# EAGLE schematic NS_ARM_Control_07_15_2017 (EAGLE 6.6.0)
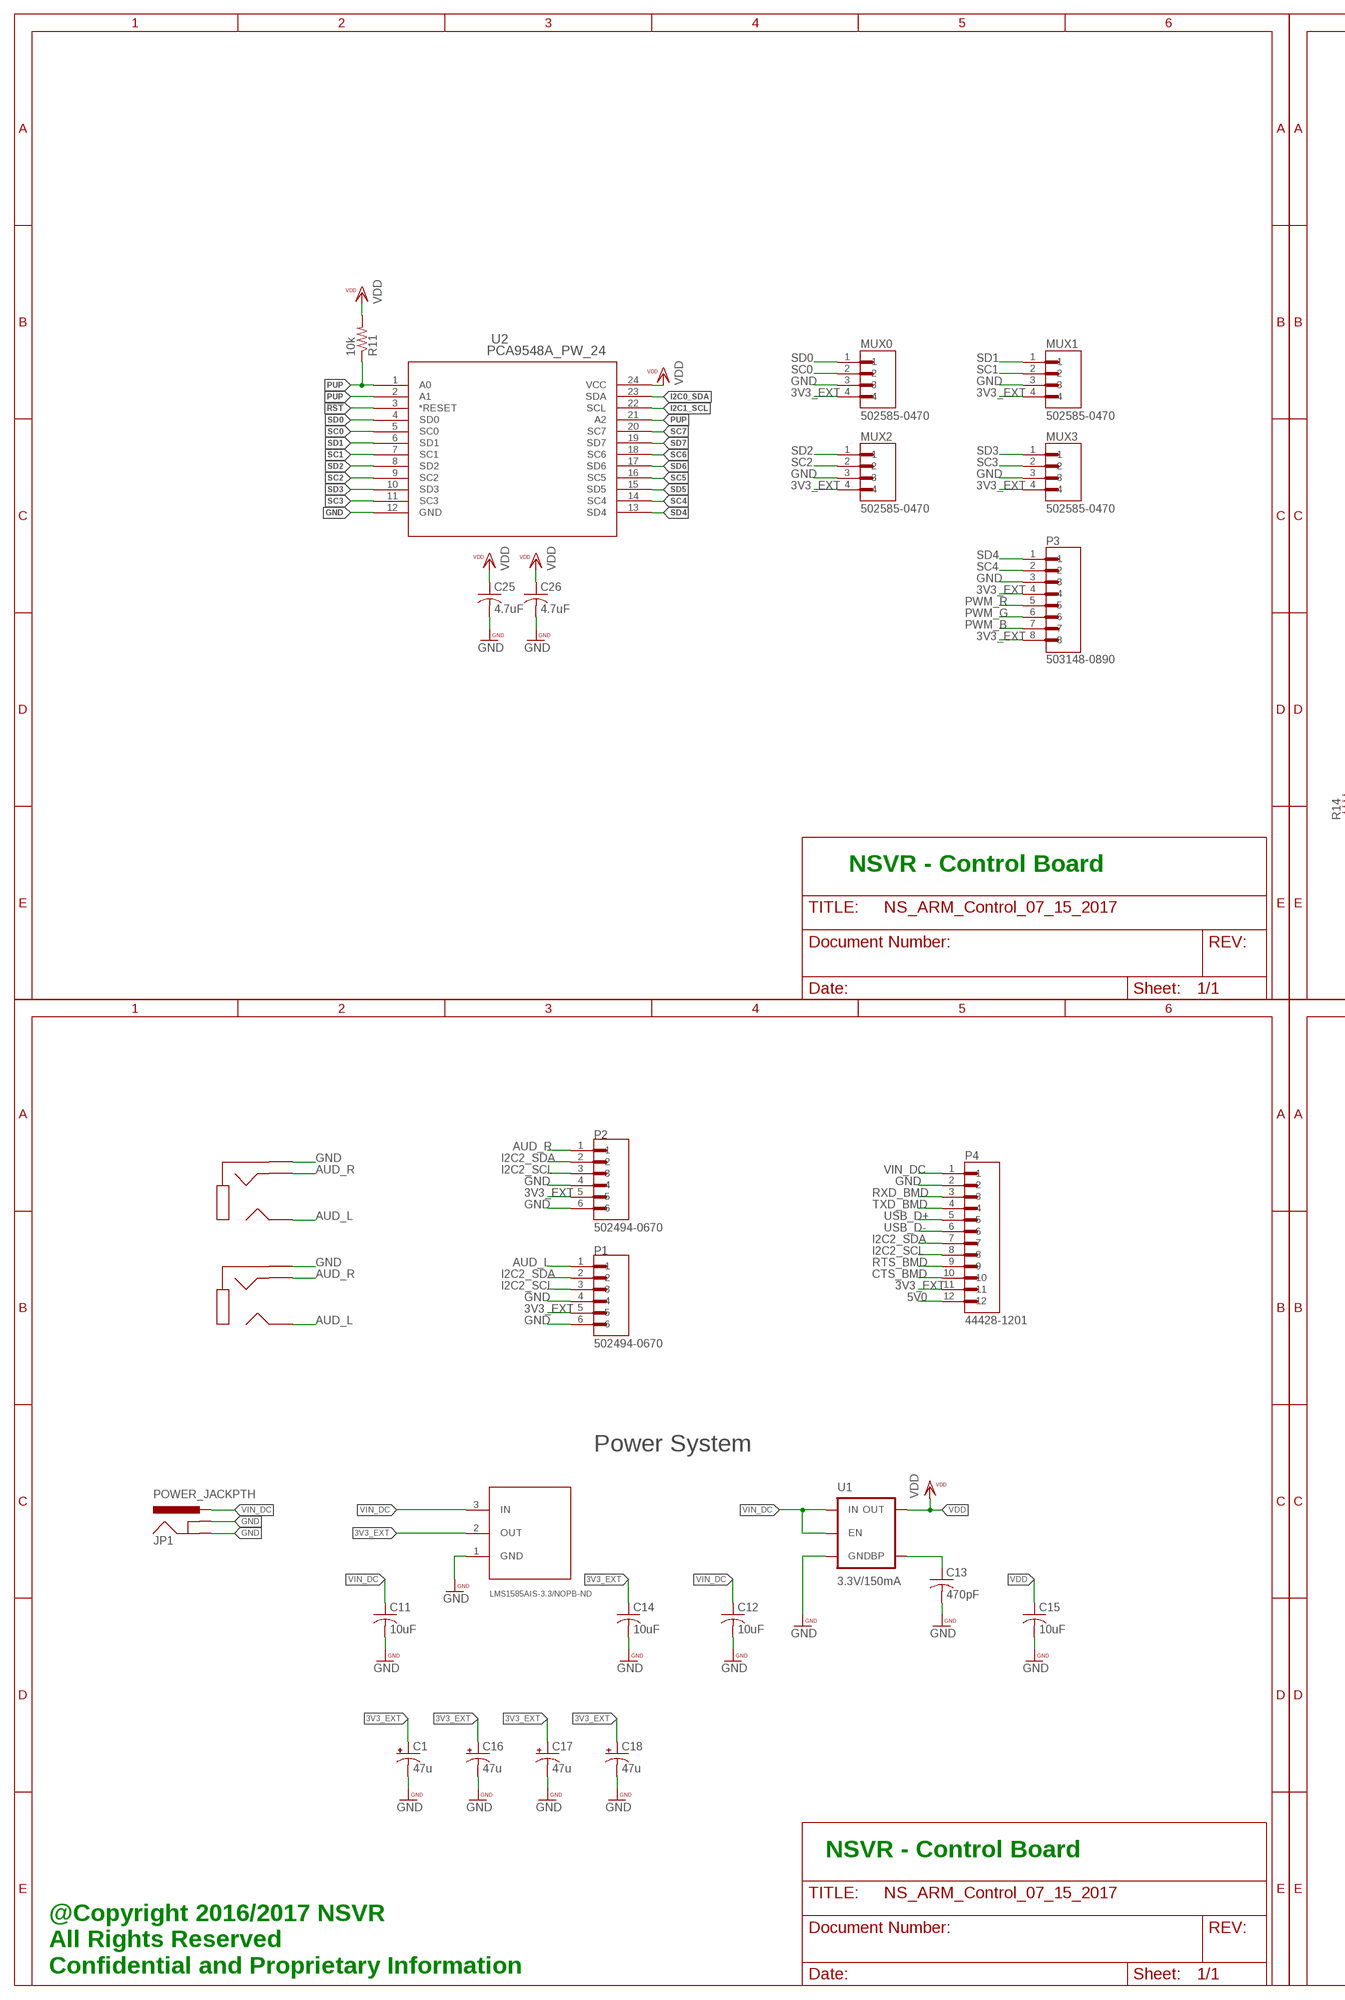
[diagram p0: schematic, sheet 1, part 1 of 2]
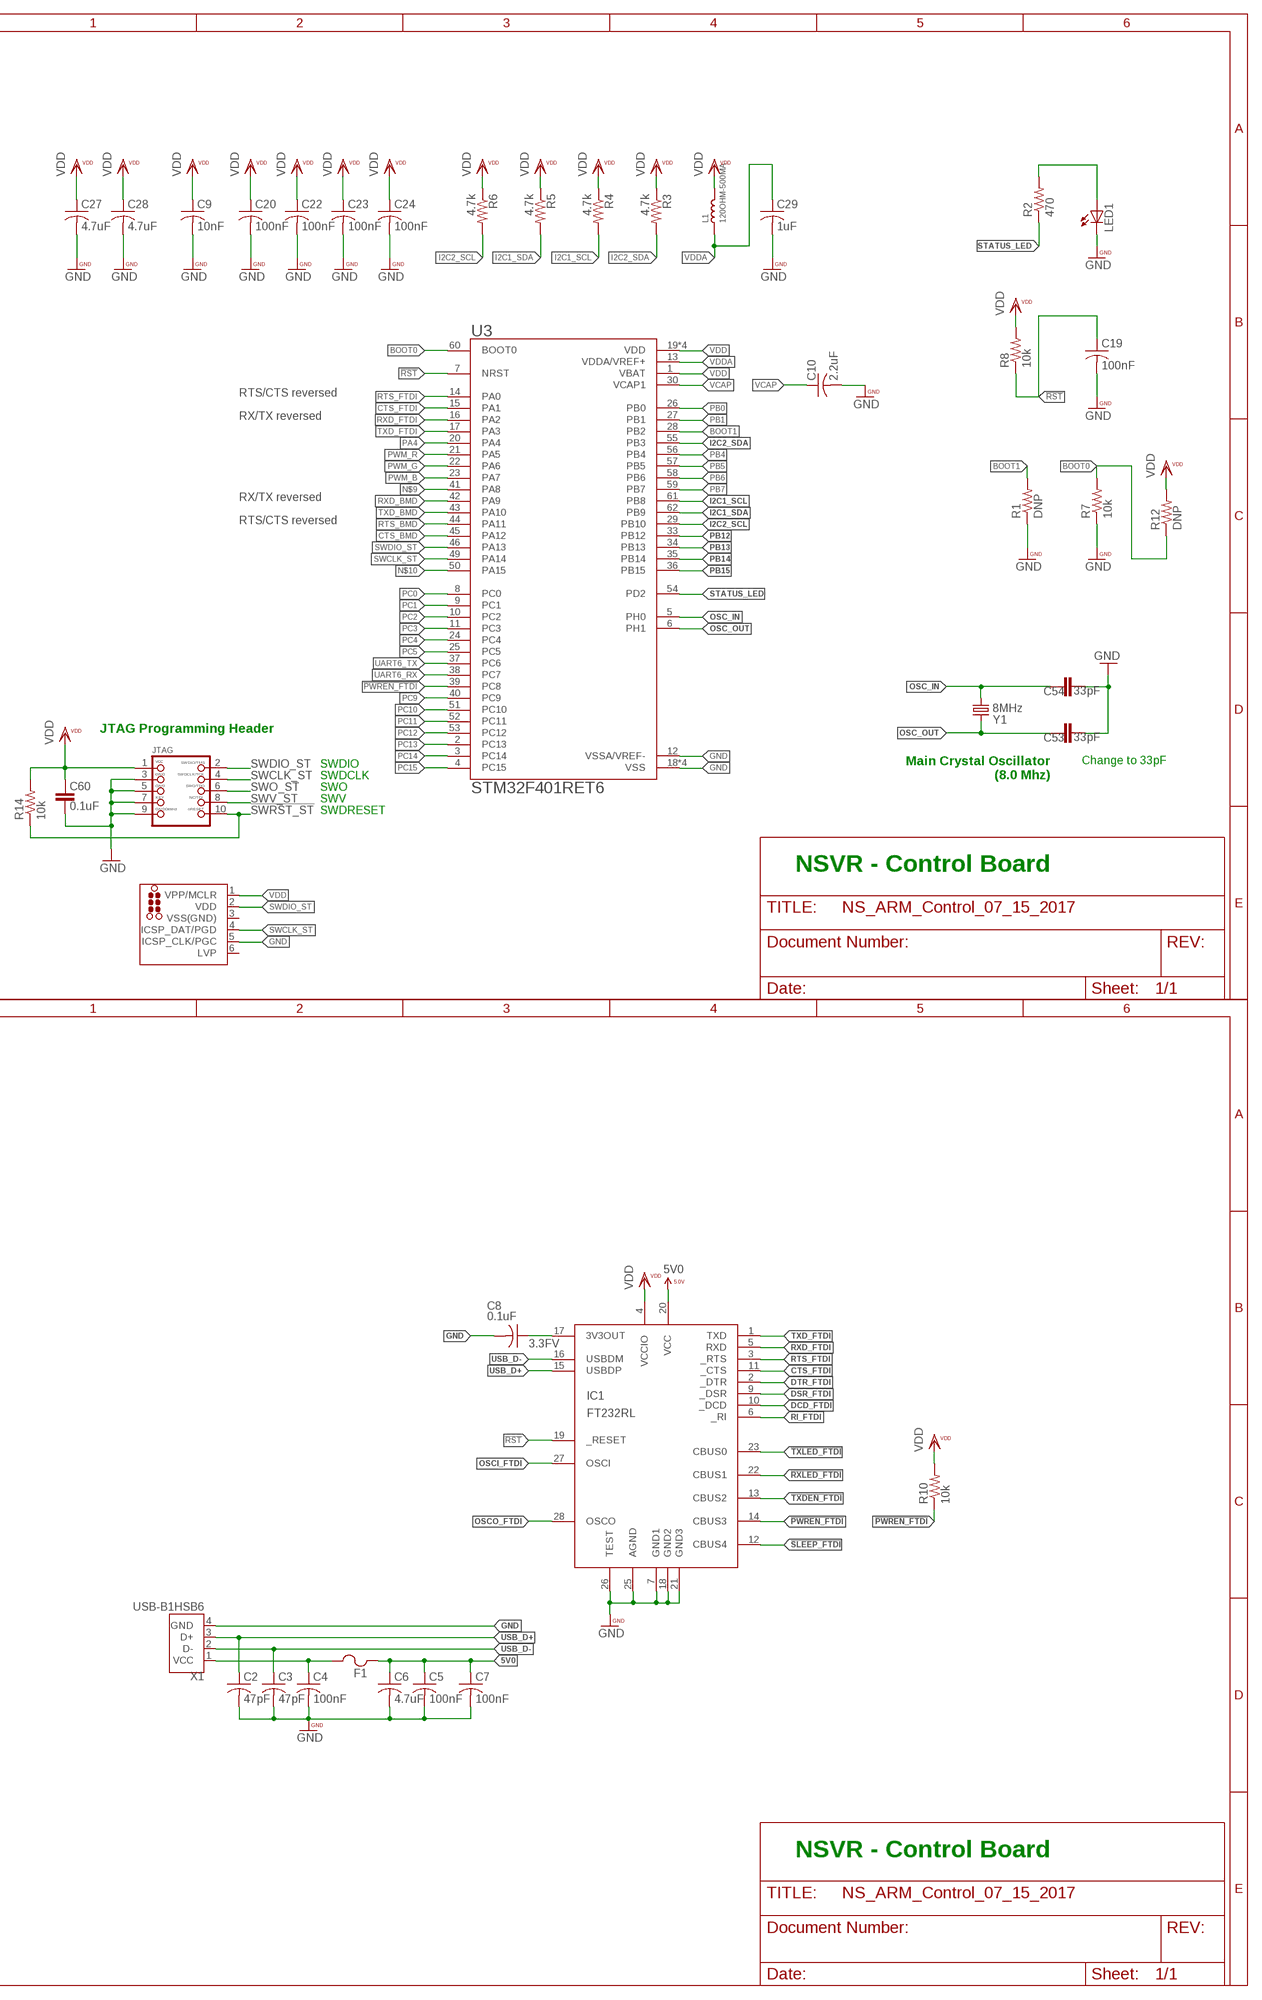
[diagram p1: schematic, sheet 1, part 2 of 2]

## Parts
C1  47u  CAP_POLD  [PANASONIC_D]
C2  47pF  C-USC0402  [C0402]
C3  47pF  C-USC0402  [C0402]
C4  100nF  C-USC0402  [C0402]
C5  100nF  C-USC0402  [C0402]
C6  4.7uF  C-USC0402  [C0402]
C7  100nF  C-USC0402  [C0402]
C8  0.1uF  C-USC0402  [C0402]
C9  10nF  C-USC0402  [C0402]
C10  2.2uF  C-USC0402  [C0402]
C11  10uF  C-USC0603  [C0603]
C12  10uF  C-USC0603  [C0603]
C13  470pF  C-USC0603  [C0603]
C14  10uF  C-USC0603  [C0603]
C15  10uF  C-USC0603  [C0603]
C16  47u  CAP_POLD  [PANASONIC_D]
C17  47u  CAP_POLD  [PANASONIC_D]
C18  47u  CAP_POLD  [PANASONIC_D]
C19  100nF  C-USC0402  [C0402]
C20  100nF  C-USC0402  [C0402]
C22  100nF  C-USC0402  [C0402]
C23  100nF  C-USC0402  [C0402]
C24  100nF  C-USC0402  [C0402]
C25  4.7uF  C-USC0402  [C0402]
C26  4.7uF  C-USC0402  [C0402]
C27  4.7uF  C-USC0402  [C0402]
C28  4.7uF  C-USC0402  [C0402]
C29  1uF  C-USC0402  [C0402]
C53  33pF  CAP0603-CAP  [0603-CAP]
C54  33pF  CAP0603-CAP  [0603-CAP]
C60  0.1uF  CAP0603-CAP  [0603-CAP]
F1  1206L050YR  [1206LSERIES]
IC1  FT232RL  [SSOP28DB]
J_ST  TC2030-MCP-NL  [TC2030-MCP-NL]
JP1  POWER_JACKPTH  [POWER_JACK_PTH]
JTAG  JTAG-CORTEXM3  [2X05_1.27MM_SMT]
L1  120OHM-500MA  SMD-FERRITE-CHIP-120-OHM-500MA(0603)  [L0603]
LED1  LEDCHIP-LED0603  [CHIP-LED0603]
MUX0  502585-0470  [MOLEX_502585-0470]
MUX1  502585-0470  [MOLEX_502585-0470]
MUX2  502585-0470  [MOLEX_502585-0470]
MUX3  502585-0470  [MOLEX_502585-0470]
P1  502494-0670  [MOLEX_502494-0670]
P2  502494-0670  [MOLEX_502494-0670]
P3  503148-0890  [MOLEX_503148-0890]
P4  44428-1201  [MOLEX_44428-1201]
R1  DNP  R-US_R0402  [R0402]
R2  470  R-US_R0402  [R0402]
R3  4.7k  R-US_R0402  [R0402]
R4  4.7k  R-US_R0402  [R0402]
R5  4.7k  R-US_R0402  [R0402]
R6  4.7k  R-US_R0402  [R0402]
R7  10k  R-US_R0402  [R0402]
R8  10k  R-US_R0402  [R0402]
R10  10k  R-US_R0402  [R0402]
R11  10k  R-US_R0402  [R0402]
R12  DNP  R-US_R0402  [R0402]
R14  10k  RESISTOR_SFE0603-RES  [0603-RES]
U1  3.3V/150mA  V_REG_MIC52053.3V  [SOT23-5]
U2  PCA9548A_PW_24  [PW24]
U3  STM32F401RET6  [QFP50P1200X1200X160-64N]
U$3  SJ1-3513N  [SJ1-351XN]
U$4  SJ1-3513N  [SJ1-351XN]
U$6  LMS1585AIS-3.3/NOPB-ND  [TO254P1524X483-4N]
X1  USB-B1HSB6  [OST_USB-B1HSB6]
Y1  8MHz  CRYSTAL5X3  [CRYSTAL-SMD-5X3]

## Nets
3.3FV: C8.1 IC1.17(3V3OUT)
3V3_EXT: C1.+ C14.1 C16.+ C17.+ C18.+ MUX0.4 MUX1.4 MUX2.4 MUX3.4 P1.5 P2.5 P3.4 P3.8 P4.11 U$6.2(OUT)
5V0: C5.1 C6.1 C7.1 F1.2 IC1.20(VCC) P4.12
!PWREN_FTDI: IC1.14(CBUS3) R10.1 U3.39(PC8)
!RST: C19.1 IC1.19(_RESET) R8.1 U2.3(*RESET) U3.7(NRST)
!RXLED_FTDI: IC1.22(CBUS1)
!SLEEP_FTDI: IC1.12(CBUS4)
!SWRST_ST: JTAG.10 R14.1
!TXDEN_FTDI: IC1.13(CBUS2)
!TXLED_FTDI: IC1.23(CBUS0)
AUD_L: P1.1 U$3.2 U$4.2
AUD_R: P2.1 U$3.3 U$4.3
BOOT0: R7.2 R12.1 U3.60(BOOT0)
BOOT1: R1.2 U3.28(PB2)
CTS_BMD: P4.10 U3.45(PA12)
CTS_FTDI: IC1.11(_CTS) U3.15(PA1)
DCD_FTDI: IC1.10(_DCD)
DSR_FTDI: IC1.9(_DSR)
DTR_FTDI: IC1.2(_DTR)
GND: C1.- C2.2 C3.2 C4.2 C5.2 C6.2 C7.2 C8.2 C9.2 C10.2 C11.2 C12.2 C13.2 C14.2 C15.2 C16.- C17.- C18.- C19.2 C20.2 C22.2 C23.2 C24.2 C25.2 C26.2 C27.2 C28.2 C29.2 C53.1 C54.1 C60.1 IC1.7(GND1) IC1.18(GND2) IC1.21(GND3) IC1.25(AGND) IC1.26(TEST) J_ST.5(ICSP_CLK/PGC) JP1.GND JP1.GNDBREAK JTAG.3 JTAG.5 JTAG.7 JTAG.9 LED1.C MUX0.3 MUX1.3 MUX2.3 MUX3.3 P1.4 P1.6 P2.4 P2.6 P3.3 P4.2 R1.1 R7.1 U1.2(GND) U2.12(GND) U3.12(VSSA/VREF-) U3.18(VSS) U3.31(VSS) U3.47(VSS) U3.63(VSS) U$3.1 U$4.1 U$6.1(GND) X1.4(GND)
I2C0_SDA: U2.23(SDA)
I2C1_SCL: R4.2 U2.22(SCL) U3.61(PB8)
I2C1_SDA: R5.2 U3.62(PB9)
I2C2_SCL: P1.3 P2.3 P4.8 R6.2 U3.29(PB10)
I2C2_SDA: P1.2 P2.2 P4.7 R3.2 U3.55(PB3)
LED1: LED1.A R2.2
N$2: C4.1 F1.1 X1.1(VCC)
N$7: C13.1 U1.4(BP)
N$9: U3.41(PA8)
N$10: U3.50(PA15)
OSC_IN: C54.2 U3.5(PH0) Y1.1
OSC_OUT: C53.2 U3.6(PH1) Y1.3
OSCI_FTDI: IC1.27(OSCI)
OSCO_FTDI: IC1.28(OSCO)
PA4: U3.20(PA4)
PB0: U3.26(PB0)
PB1: U3.27(PB1)
PB4: U3.56(PB4)
PB5: U3.57(PB5)
PB6: U3.58(PB6)
PB7: U3.59(PB7)
PB12: U3.33(PB12)
PB13: U3.34(PB13)
PB14: U3.35(PB14)
PB15: U3.36(PB15)
PC0: U3.8(PC0)
PC1: U3.9(PC1)
PC2: U3.10(PC2)
PC3: U3.11(PC3)
PC4: U3.24(PC4)
PC5: U3.25(PC5)
PC9: U3.40(PC9)
PC10: U3.51(PC10)
PC11: U3.52(PC11)
PC12: U3.53(PC12)
PC13: U3.2(PC13)
PC14: U3.3(PC14)
PC15: U3.4(PC15)
PUP: R11.1 U2.1(A0) U2.2(A1) U2.21(A2)
PWM_B: P3.7 U3.23(PA7)
PWM_G: P3.6 U3.22(PA6)
PWM_R: P3.5 U3.21(PA5)
RI_FTDI: IC1.6(_RI)
RTS_BMD: P4.9 U3.44(PA11)
RTS_FTDI: IC1.3(_RTS) U3.14(PA0)
RXD_BMD: P4.3 U3.42(PA9)
RXD_FTDI: IC1.5(RXD) U3.16(PA2)
SC0: MUX0.2 U2.5(SC0)
SC1: MUX1.2 U2.7(SC1)
SC2: MUX2.2 U2.9(SC2)
SC3: MUX3.2 U2.11(SC3)
SC4: P3.2 U2.14(SC4)
SC5: U2.16(SC5)
SC6: U2.18(SC6)
SC7: U2.20(SC7)
SD0: MUX0.1 U2.4(SD0)
SD1: MUX1.1 U2.6(SD1)
SD2: MUX2.1 U2.8(SD2)
SD3: MUX3.1 U2.10(SD3)
SD4: P3.1 U2.13(SD4)
SD5: U2.15(SD5)
SD6: U2.17(SD6)
SD7: U2.19(SD7)
STATUS_LED: R2.1 U3.54(PD2)
SWCLK_ST: J_ST.4(ICSP_DAT/PGD) JTAG.4 U3.49(PA14)
SWDIO_ST: J_ST.2(VDD) JTAG.2 U3.46(PA13)
SWO_ST: JTAG.6
SWV_ST: JTAG.8
TXD_BMD: P4.4 U3.43(PA10)
TXD_FTDI: IC1.1(TXD) U3.17(PA3)
UART6_RX: U3.38(PC7)
UART6_TX: U3.37(PC6)
USB_D+: C2.1 IC1.15(USBDP) P4.5 X1.3(D+)
USB_D-: C3.1 IC1.16(USBDM) P4.6 X1.2(D-)
VCAP: C10.1 U3.30(VCAP1)
VDD: C9.1 C15.1 C20.1 C22.1 C23.1 C24.1 C25.1 C26.1 C27.1 C28.1 C60.2 IC1.4(VCCIO) J_ST.1(VPP/MCLR) JTAG.1 L1.2 R3.1 R4.1 R5.1 R6.1 R8.2 R10.2 R11.2 R12.2 R14.2 U1.5(OUT) U2.24(VCC) U3.1(VBAT) U3.19(VDD) U3.32(VDD) U3.48(VDD) U3.64(VDD)
VDDA: C29.1 L1.1 U3.13(VDDA/VREF+)
VIN_DC: C11.1 C12.1 JP1.PWR P4.1 U1.1(IN) U1.3(EN) U$6.3(IN)
Unconnected: J_ST.6(LVP)

## Notes on the sheet
- RTS/CTS reversed
- RX/TX reversed
- RX/TX reversed
- RTS/CTS reversed
- JTAG Programming Header
- Main Crystal Oscillator
      (8.0 Mhz)
- Change to 33pF
- SWDIO
- SWDCLK
- SWO
- SWV
- SWDRESET
- NSVR - Control Board | NSVR - Control Board
- Power System
- NSVR - Control Board | NSVR - Control Board
- @Copyright 2016/2017 NSVR
  All Rights Reserved
  Confidential and Proprietary Information

## Power pins joined to a net without a drawn wire
VSS(GND): J_ST.3(VSS(GND))

## Library data of the parts
C1 C16-C18 = SparkFun-Capacitors:CAP_POL: Capacitor Polarized These are standard SMD and PTH capacitors. Normally 10uF, 47uF, and 100uF in electrolytic and tantalum varieties. Always verify the external diameter of the through hole cap, it varies with capacity, voltage, and manufacturer. The EIA devices should be standard.
C2-C15 C19 C20 C22-C29 = rcl:C-US: CAPACITOR, American symbol
C53 C54 C60 = BeeSafe:CAP: Capacitor Standard 0603 ceramic capacitor, and 0.1" leaded capacitor.
F1 = 1206L050:1206L050YR; COPYRIGHT: Copyright C 2015 Accelerated Designs. All rights reserved; MANUFACTURER_PART_NUMBER: 1206L050YR; VENDOR: Littelfuse Inc
IC1 = ftdichip-3:FT232RL: USB UART 4th Generation USB UART (USB <-> Serial) Controller
J_ST = tag-connect:TC2030: TAG-CONNECT ICSP Connector Manufacturer: Tag-Connect <http://www.tag-connect.com> Cable for easy In-Circuit Serial Programming. Designed for Microchip ICD2, suitable for many others. Two variants - one "with legs" (for hands-free fit on PCB) and another "without legs" for quick programming. PAD Description 1 MCLR/Vpp 2 Vdd 3 GND 4 PGD (ISPDAT) 5 PGC (ISPCLK) 6 nc (used for LVP) ©2009 ROFA.cz - modified and updated by Robert Darlington ‹rdarlington@gmail.com›
JP1 = SparkFun-Connectors:POWER_JACK: Power Jack This is the standard 5.5mm barrel jack for power. The PTH is the most common, proven, reliable, footprint. The Slot footprint only works if the mill layer is transmitted to the PCB fab house so be warned. Mating wall wart : TOL-00298 (and others); PROD_ID: CONN-08197
JTAG = PatternAgents-Cypress:JTAG-CORTEXM3: JTAG Programming Connector LBR Source: http://www.patternagents.com THIS SOFTWARE IS PROVIDED BY THE CONTRIBUTORS "AS IS" AND WITHOUT ANY EXPRESS OR IMPLIED WARRANTIES, INCLUDING, BUT NOT LIMITED TO, THE IMPLIED WARRANTIES OF MERCHANTABILITY AND FITNESS FOR A PARTICULAR PURPOSE ARE DISCLAIMED. IN NO EVENT SHALL THE COPYRIGHT OWNER OR CONTRIBUTORS BE LIABLE FOR ANY DIRECT, INDIRECT, INCIDENTAL, SPECIAL, EXEMPLARY, OR CONSEQUENTIAL DAMAGES (INCLUDING, BUT NOT LIMITED TO, PROCUREMENT OF SUBSTITUTE GOODS OR SERVICES; LOSS OF USE, DATA, OR PROFITS; OR BUSINESS INTERRUPTION) HOWEVER CAUSED AND ON ANY THEORY OF LIABILITY, WHETHER IN CONTRACT, STRICT LIABILITY, OR TORT (INCLUDING NEGLIGENCE OR OTHERWISE) ARISING IN ANY WAY OUT OF THE USE OF THIS SOFTWARE, EVEN IF ADVISED OF THE POSSIBILITY OF SUCH DAMAGE.
L1 = Seeed-Inductor-2016:SMD-FERRITE-CHIP-120-OHM-500MA(0603): 303030001; MPN: BLM18AG121SN1D
LED1 = led:LED: LED OSRAM: - CHIPLED LG R971, LG N971, LY N971, LG Q971, LY Q971, LO R971, LY R971 LH N974, LH R974 LS Q976, LO Q976, LY Q976 LO Q996 - Hyper CHIPLED LW Q18S LB Q993, LB Q99A, LB R99A - SideLED LS A670, LO A670, LY A670, LG A670, LP A670 LB A673, LV A673, LT A673, LW A673 LH A674 LY A675 LS A676, LA A676, LO A676, LY A676, LW A676 LS A679, LY A679, LG A679 - Hyper Micro SIDELED® LS Y876, LA Y876, LO Y876, LY Y876 LT Y87S - SmartLED LW L88C, LW L88S LB L89C, LB L89S, LG L890 LS L89K, LO L89K, LY L89K LS L896, LA L896, LO L896, LY L896 - TOPLED LS T670, LO T670, LY T670, LG T670, LP T670 LSG T670, LSP T670, LSY T670, LOP T670, LYG T670 LG T671, LOG T671, LSG T671 LB T673, LV T673, LT T673, LW T673 LH T674 LS T676, LA T676, LO T676, LY T676, LB T676, LH T676, LSB T676, LW T676 LB T67C, LV T67C, LT T67C, LS T67K, LO T67K, LY T67K, LW E67C LS E67B, LA E67B, LO E67B, LY E67B, LB E67C, LV E67C, LT E67C LW T67C LS T679, LY T679, LG T679 LS T770, LO T770, LY T770, LG T770, LP T770 LB T773, LV T773, LT T773, LW T773 LH T774 LS E675, LA E675, LY E675, LS T675 LS T776, LA T776, LO T776, LY T776, LB T776 LHGB T686 LT T68C, LB T68C - Hyper Mini TOPLED® LB M676 - Mini TOPLED Santana® LG M470 LS M47K, LO M47K, LY M47K Source: http://www.osram.convergy.de LUXEON: - LUMILED® LXK2-PW12-R00, LXK2-PW12-S00, LXK2-PW14-U00, LXK2-PW14-V00 LXK2-PM12-R00, LXK2-PM12-S00, LXK2-PM14-U00 LXK2-PE12-Q00, LXK2-PE12-R00, LXK2-PE12-S00, LXK2-PE14-T00, LXK2-PE14-U00 LXK2-PB12-K00, LXK2-PB12-L00, LXK2-PB12-M00, LXK2-PB14-N00, LXK2-PB14-P00, LXK2-PB14-Q00 LXK2-PR12-L00, LXK2-PR12-M00, LXK2-PR14-Q00, LXK2-PR14-R00 LXK2-PD12-Q00, LXK2-PD12-R00, LXK2-PD12-S00 LXK2-PH12-R00, LXK2-PH12-S00 LXK2-PL12-P00, LXK2-PL12-Q00, LXK2-PL12-R00 Source: www.luxeon.com KINGBRIGHT: KA-3528ASYC Source: www.kingbright.com
MUX0 MUX1-MUX3 = 502585-0470:502585-0470: 1.50mm Pitch CLIK-Mate™ Wire-to-Board PCB Receptacle, Single Row, Right Angle, 4 Circuits; AVAILABILITY: Good; DESCRIPTION: 1.50mm Pitch CLIK-Mate™ Wire-to-Board PCB Receptacle, Single Row, Right Angle, 4 Circuits; MF: Molex; MP: 502585-0470; PACKAGE: None; PRICE: 0.44 USD
P1 P2 = 502494-0670:502494-0670: 2.00mm Pitch CLIK-Mate™ Wire-to-Board PCB Receptacle, Single Row, Right Angle, 6 Circuits; AVAILABILITY: Good; DESCRIPTION: 2.00mm Pitch CLIK-Mate™ Wire-to-Board PCB Receptacle, Single Row, Right Angle, 6 Circuits; MF: Molex; MP: 502494-0670; PACKAGE: None; PRICE: 0.53 USD
P3 = 503148-0890:503148-0890: 1.5wb Dual r/a Embs Tape Pkg 8p; AVAILABILITY: Good; DESCRIPTION: 1.5wb Dual r/a Embs Tape Pkg 8p; MF: Molex; MP: 503148-0890; PACKAGE: None; PRICE: 1.11 USD
P4 = 44428-1201:44428-1201: Conn Wire to Board HDR 12 POS 3mm Solder RA Thru-Hole Micro-Fit 3.0 BMI? Tray; AVAILABILITY: Good; DESCRIPTION: Conn Wire to Board HDR 12 POS 3mm Solder RA Thru-Hole Micro-Fit 3.0 BMI? Tray; MF: Molex; MP: 44428-1201; PACKAGE: None; PRICE: 2.39 USD
R1-R8 R10-R12 = rcl:R-US_: RESISTOR, American symbol
R14 = PatternAgents-Misc:RESISTOR_SFE: Resistor Basic schematic elements and footprints for 0603, 1206, and PTH resistors.
U1 = SparkFun-PowerIC:V_REG_MIC5205: V_REG MIC5205 Standard 3.3V, 5V, and Adjustable 150mA LDO voltage regulator in SOT-23 layout. Micrel part MIC5205. BP (by-pass) pin is used to lower output noise with 470pF cap, may be left open. On the adjustable version BP is used to set output.; PROD_ID: VREG-00822
U2 = PCA9548A_PW_124:PCA9548A_PW_24; DATASHEETURL: http://www.ti.com/lit/gpn/PCA9548A; DESCRIPTION: 8-Channel I2C Switch With Reset; FAMILY_NAME: I2C MULTIPLEXER, SWITCH; GENERIC_PART_NUMBER: PCA9548A; INDUSTRY_STD_PKG_TYPE: TSSOP; MANUFACTURER: Texas Instruments; MANUFACTURER_PART_NUMBER: pca9548a_pw_24; PACKAGE_DESIGNATOR: PW; PIN_COUNT: 24; VENDOR: Texas Instruments
U3 = STM32F401RET6:STM32F401RET6: MCU 32-Bit STM32 ARM Cortex M4 RISC 512KB Flash 1.8V/2.5V/3.3V 64-Pin LQFP Tray; AVAILABILITY: Good; DESCRIPTION: MCU 32-Bit STM32 ARM Cortex M4 RISC 512KB Flash 1.8V/2.5V/3.3V 64-Pin LQFP Tray; MF: STMicroelectronics; MP: STM32F401RET6; PACKAGE: LQFP-64 STMicroelectronics; PRICE: 4.74 USD
U$3 U$4 = audio_mux:SJ1-3513N
U$6 = TO254P1524X483-4N:LMS1585AIS-3.3/NOPB-ND
X1 = USB-B1HSB6:USB-B1HSB6: Conn Usb Type b r/a Black; AVAILABILITY: Warning; DESCRIPTION: Conn Usb Type b r/a Black; MF: On Shore Technology; MP: USB-B1HSB6; PACKAGE: None; PRICE: 0.42 USD
Y1 = SparkFun2:CRYSTAL: Crystals Various standard crystals. Proven footprints. Spark Fun Electronics SKU : COM-00534

## Net classes
1 vcc: width 0.254 mm